# EAGLE design Adafruit Cobbler (EAGLE 7.7.0)
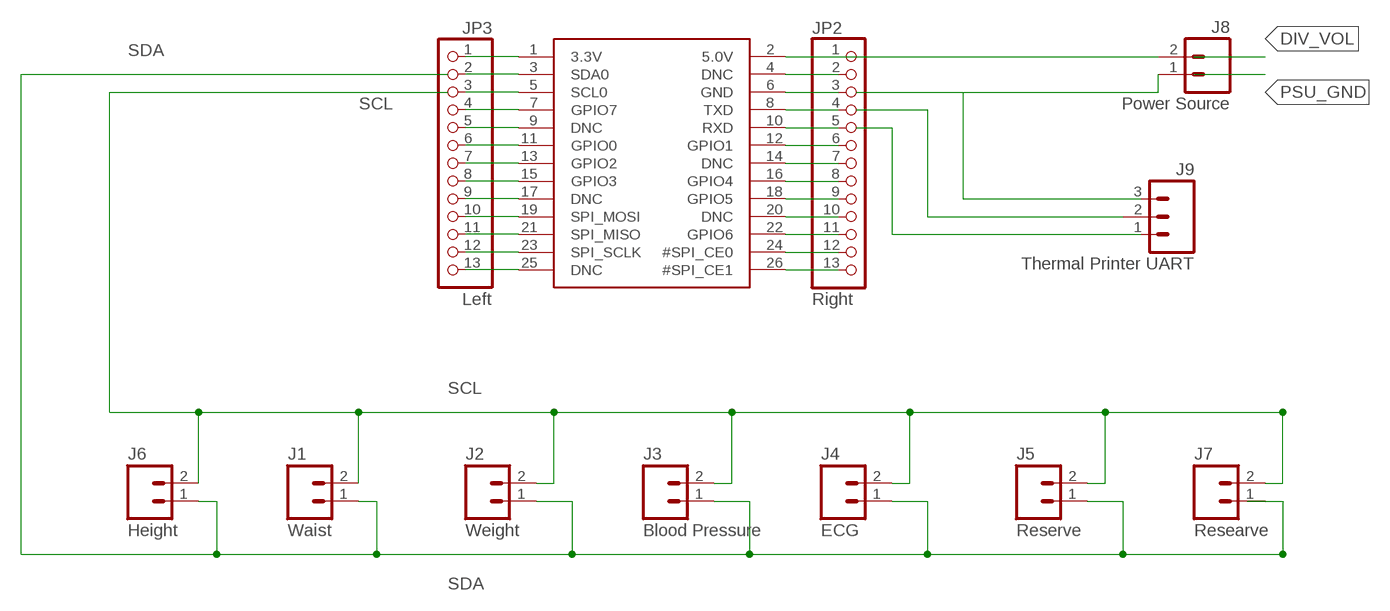
[diagram p0: schematic, sheet 1]

## Parts
J1  Waist  M02JST-PTH-2-KIT  [JST-2-PTH-KIT]
J2  Weight  M02JST-PTH-2-KIT  [JST-2-PTH-KIT]
J3  Blood Pressure  M02JST-PTH-2-KIT  [JST-2-PTH-KIT]
J4  ECG  M02JST-PTH-2-KIT  [JST-2-PTH-KIT]
J5  Reserve  M02JST-PTH-2-KIT  [JST-2-PTH-KIT]
J6  Height  M02JST-PTH-2-KIT  [JST-2-PTH-KIT]
J7  Researve  M02JST-PTH-2-KIT  [JST-2-PTH-KIT]
J8  Power Source  M02JST-PTH-2-KIT  [JST-2-PTH-KIT]
J9  Thermal Printer UART  M03JST-PTH  [JST-3-PTH]
JP1  PI  RASBERRYPI_IDC  [RASBERRYPI_IDC]
JP2  Right  HEADER-1X1380MIL  [1X13_ROUND_76MIL]
JP3  Left  HEADER-1X1380MIL  [1X13_ROUND_76MIL]

## Nets
3.3V: JP1.1(3.3V) JP3.1
5.0V: J8.2 JP1.2(5.0V) JP2.1
GND: JP1.6(GND) JP2.3
N$1: JP1.3(SDA0) JP3.2
N$2: JP1.5(SCL0) JP3.3
N$3: JP1.7(GPIO7) JP3.4
N$4: JP1.9(DNC) JP3.5
N$5: JP1.11(GPIO0) JP3.6
N$6: JP1.13(GPIO2) JP3.7
N$7: JP1.15(GPIO3) JP3.8
N$8: JP1.17(DNC) JP3.9
N$9: JP1.19(SPI_MOSI) JP3.10
N$10: JP1.21(SPI_MISO) JP3.11
N$11: JP1.23(SPI_SCLK) JP3.12
N$12: JP1.25(DNC) JP3.13
N$13: JP1.4(DNC) JP2.2
N$14: J8.1
N$15: JP1.8(TXD) JP2.4
N$16: JP1.10(RXD) JP2.5
N$17: JP1.12(GPIO1) JP2.6
N$18: JP1.14(DNC) JP2.7
N$19: JP1.16(GPIO4) JP2.8
N$20: JP1.18(GPIO5) JP2.9
N$21: JP1.20(DNC) JP2.10
N$22: JP1.22(GPIO6) JP2.11
N$23: JP1.24(#SPI_CE0) JP2.12
N$24: JP1.26(#SPI_CE1) JP2.13
N$25: J9.2
SCL: J1.2 J2.2 J3.2 J4.2 J5.2 J6.2 J7.2
SDA: J1.1 J2.1 J3.1 J4.1 J5.1 J6.1
Unconnected: J7.1 J9.1 J9.3

## Library data of the parts
J1-J8 = SparkFun-Connectors:M02: Standard 2-pin 0.1" header. Use with - straight break away headers ( PRT-00116) - right angle break away headers (PRT-00553) - swiss pins (PRT-00743) - machine pins (PRT-00117) - female headers (PRT-00115) Molex polarized connector foot print use with: PRT-08233 with associated crimp pins and housings. 2.54_SCREWTERM for use with PRT-10571. 3.5mm Screw Terminal footprints for PRT-08084 5mm Screw Terminal footprints for use with PRT-08432
J9 = SparkFun-Connectors:M03: Header 3 Standard 3-pin 0.1" header. Use with straight break away headers (SKU : PRT-00116), right angle break away headers (PRT-00553), swiss pins (PRT-00743), machine pins (PRT-00117), and female headers (PRT-00115). Molex polarized connector foot print use with SKU : PRT-08232 with associated crimp pins and housings.; SKU: PRT-09915
JP1 = microbuilder:RASBERRYPI_IDC: Rasberry PI IDC Header
JP2 JP3 = microbuilder:HEADER-1X13

## Board
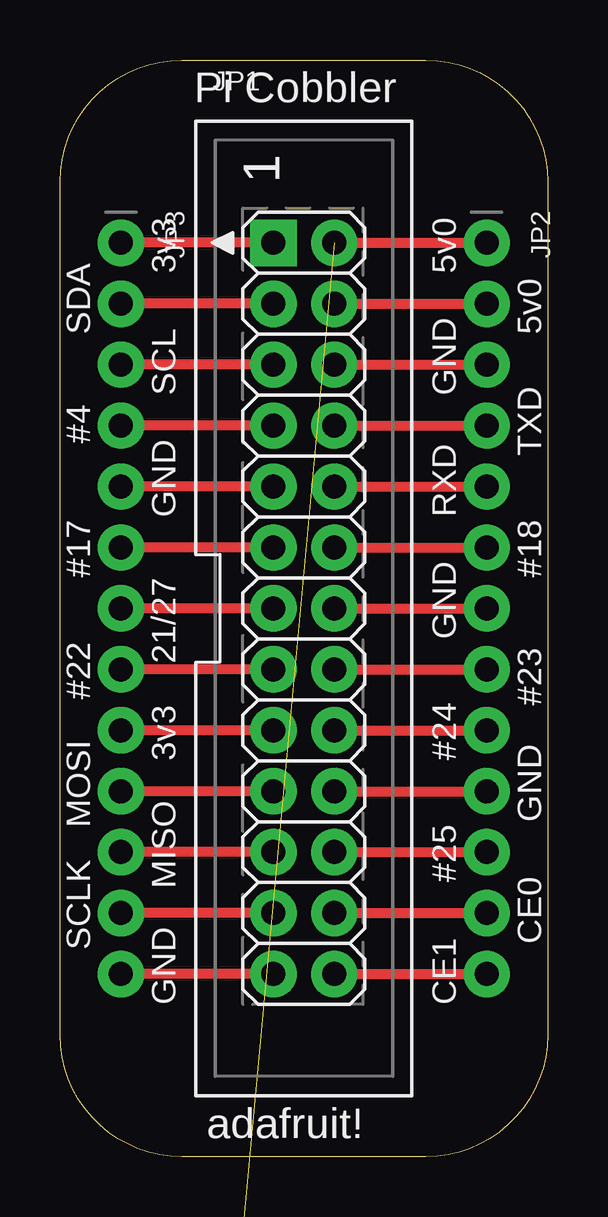
[diagram p1: board, top side]

Size 20.32 x 45.72 mm. Coordinates in mm from the lower left corner, seen from the top.
Outline: 0,5.08 0,40.64 arc-90 5.08,45.72 15.24,45.72 arc-90 20.32,40.64 20.32,5.08 arc-90 15.24,0 5.08,0 arc-90 0,5.08
Copper layers (1*16): Top 0.035mm / dielectric 1.5mm / Bottom 0.035mm
Design rules "default": minimum track width 8mil, minimum drill 0.4mm, track to track 8mil, track to pad 8mil, pad to pad 8mil, via to via 8mil, smd to smd 8mil, copper to edge 20mil, drill to drill 8mil, minimum pad ring 8mil, minimum via ring 10mil, stop-mask expansion 3mil, vias tented up to drill 0mil, thermal gap 8mil

### Footprints (pad centres in the part's own frame; a part is rotated, then mirrored left to right if it is on the bottom)
JST-2-PTH-KIT = drill 0.7 pad 1.448: 1 -1,0; 2 1,0
JST-3-PTH = drill 0.7 pad 1.6: 1 -2,0; 2 0,0; 3 2,0
RASBERRYPI_IDC = drill 1 pad 1.93 square: 1 -1.27,15.24 | drill 1 pad 1.93: 2 1.27,15.24; 3 -1.27,12.7; 4 1.27,12.7; 5 -1.27,10.16; 6 1.27,10.16; 7 -1.27,7.62; 8 1.27,7.62; 9 -1.27,5.08; 10 1.27,5.08; 11 -1.27,2.54; 12 1.27,2.54; 13 -1.27,0; 14 1.27,0; 15 -1.27,-2.54; 16 1.27,-2.54; 17 -1.27,-5.08; 18 1.27,-5.08; 19 -1.27,-7.62; 20 1.27,-7.62; 21 -1.27,-10.16; 22 1.27,-10.16; 23 -1.27,-12.7; 24 1.27,-12.7; 25 -1.27,-15.24; 26 1.27,-15.24
1X13_ROUND_76MIL = drill 1 pad 1.93: 1 -15.24,0; 2 -12.7,0; 3 -10.16,0; 4 -7.62,0; 5 -5.08,0; 6 -2.54,0; 7 0,0; 8 2.54,0; 9 5.08,0; 10 7.62,0; 11 10.16,0; 12 12.7,0; 13 15.24,0

### Placement (x,y rotation side)
J1  -4.32,-19.56 0 top  (outside the outline)
J2  -4.32,-34.04 0 top  (outside the outline)
J3  -4.32,-48.51 0 top  (outside the outline)
J4  -4.32,-62.99 0 top  (outside the outline)
J5  -4.32,-77.47 0 top  (outside the outline)
J6  -4.32,-91.95 0 top  (outside the outline)
J7  -4.32,-106.43 0 top  (outside the outline)
J8  -4.32,-120.9 0 top  (outside the outline)
J9  -2.54,-136.14 0 top  (outside the outline)
JP1  10.16,22.86 0 top
JP2  17.78,22.86 270 top
JP3  2.54,22.86 270 top

### Tracks (layer width: path | path; a pad name or v marks a point on that pad's centre or on a via)
3.3V
  Top 0.406: JP1.1 JP3.1
5.0V  (1 unrouted)
  Top 0.406: JP1.2 JP2.1
GND
  Top 0.406: JP1.6 JP2.3
N$1
  Top 0.406: JP1.3 JP3.2
N$2
  Top 0.406: JP1.5 JP3.3
N$3
  Top 0.406: JP1.7 JP3.4
N$4
  Top 0.406: JP1.9 JP3.5
N$5
  Top 0.406: JP1.11 JP3.6
N$6
  Top 0.406: JP1.13 JP3.7
N$7
  Top 0.406: JP1.15 JP3.8
N$8
  Top 0.406: JP1.17 JP3.9
N$9
  Top 0.406: JP1.19 JP3.10
N$10
  Top 0.406: JP1.21 JP3.11
N$11
  Top 0.406: JP1.23 JP3.12
N$12
  Top 0.406: JP1.25 JP3.13
N$13
  Top 0.406: JP1.4 JP2.2
N$15
  Top 0.406: JP1.8 JP2.4
N$16
  Top 0.406: JP1.10 JP2.5
N$17
  Top 0.406: JP1.12 JP2.6
N$18
  Top 0.406: JP1.14 JP2.7
N$19
  Top 0.406: JP1.16 JP2.8
N$20
  Top 0.406: JP1.18 JP2.9
N$21
  Top 0.406: JP1.20 JP2.10
N$22
  Top 0.406: JP1.22 JP2.11
N$23
  Top 0.406: JP1.24 JP2.12
N$24
  Top 0.406: JP1.26 12.19,7.62 JP2.13
SCL  (6 unrouted)
SDA  (5 unrouted)

### Text on the board
tPlace: Pi Cobbler | 3v3 | 5v0 | SDA | 5v0 | SCL | GND | #4 | TXD | GND | RXD | #17 | #18 | GND | 21/27 | #22 | #23 | 3v3 | #24 | MOSI | GND | MISO | #25 | SCLK | CE0 | GND | CE1 | adafruit!